# EAGLE design electrode (EAGLE 9.4.2)
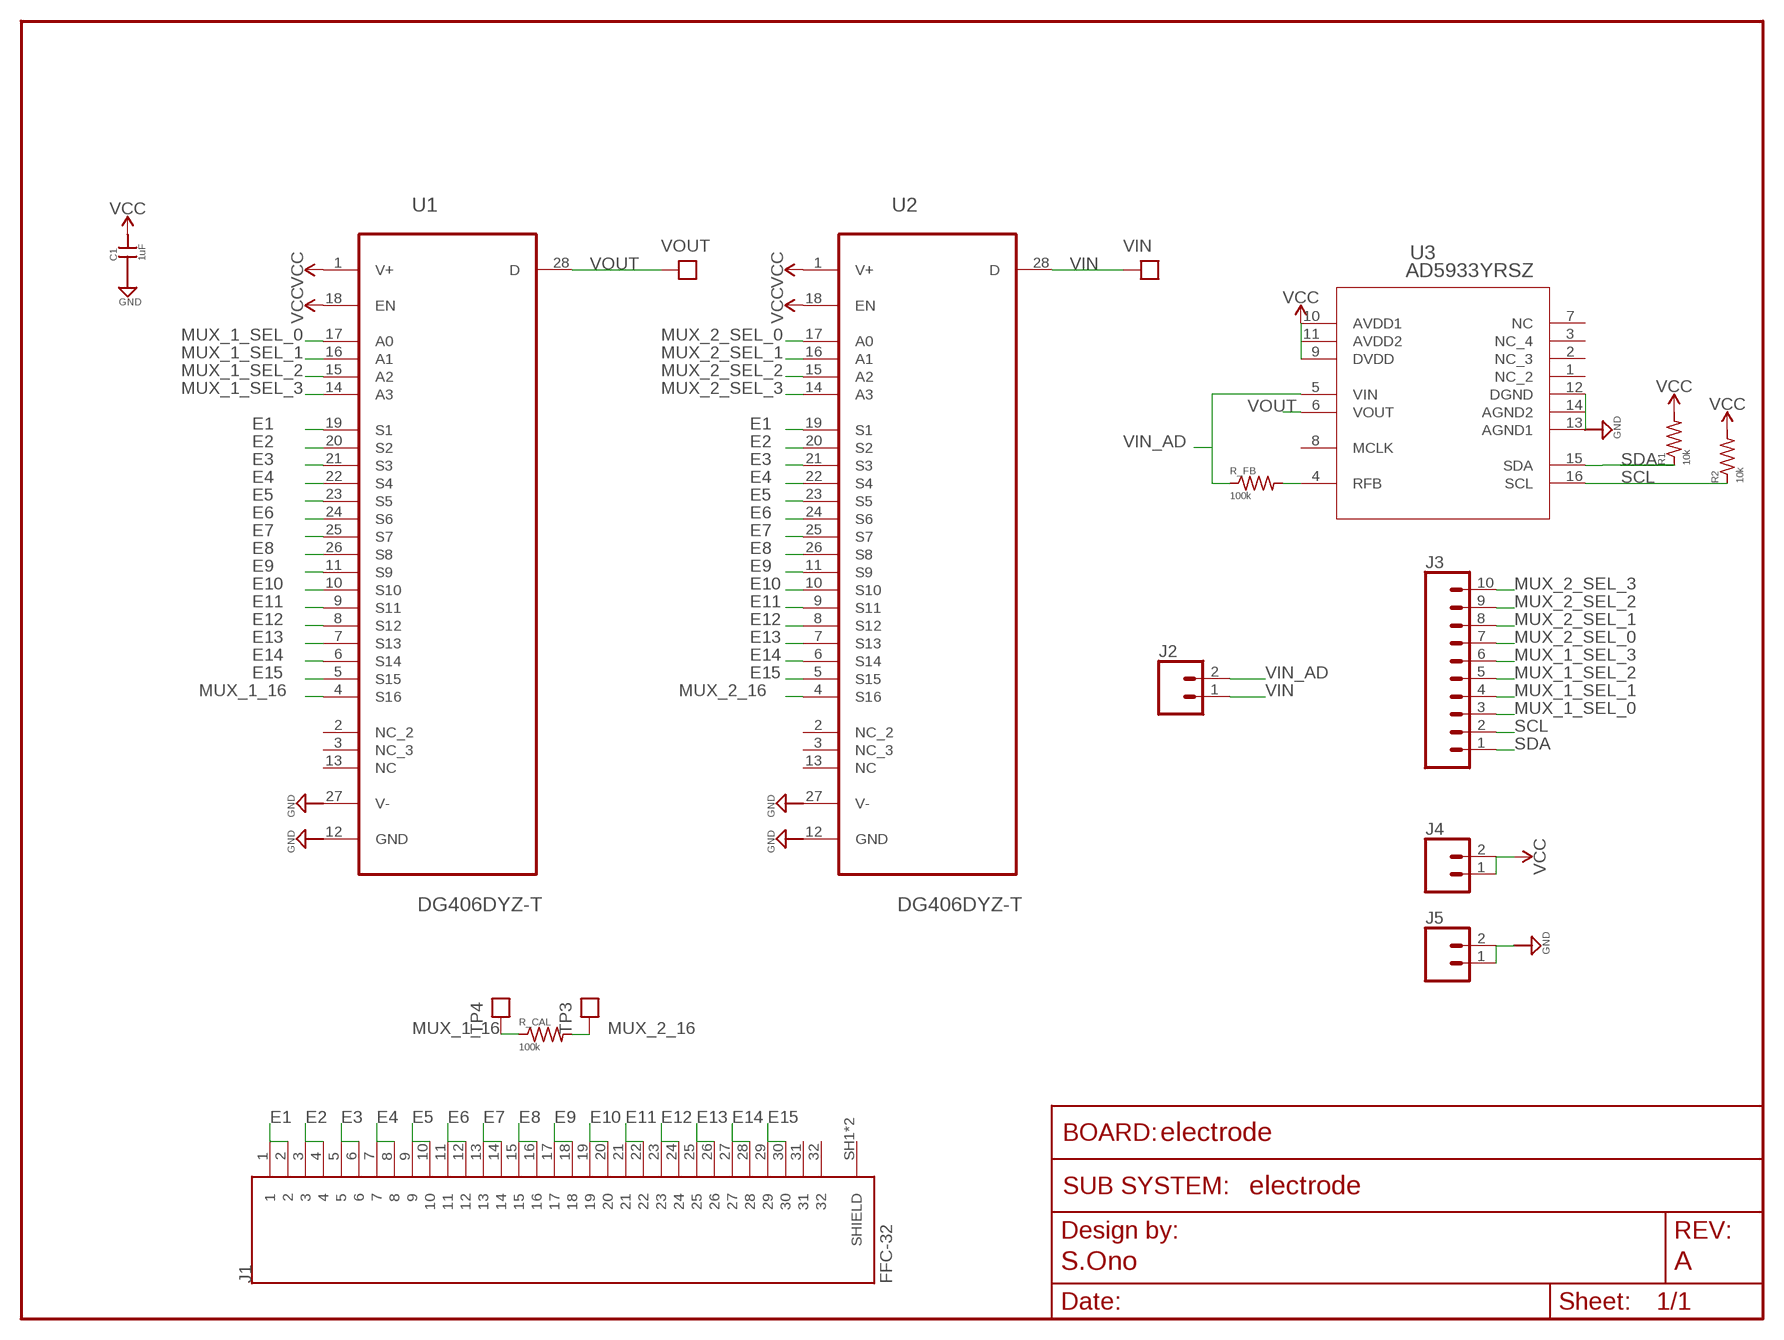
[diagram p0: schematic, sheet 1]
FRAME1 (FRAME_SCHEMATIC): AUTHOR: S.Ono; REV: A; SUBSYSTEM_NAME: electrode

## Parts
C1  1uF  CAP0603-CAP  [0603-CAP]
J1  FFC-32  [MOLEX_503480-3200]
J2  CONN_02  [1X02]
J3  CONN_10"  [1X10]
J4  CONN_02  [1X02]
J5  CONN_02  [1X02]
R1  10k  R-US_0603  [0603-RES]
R2  10k  R-US_0603  [0603-RES]
R_CAL  100k  R-US_0603  [0603-RES]
R_FB  100k  R-US_0603  [0603-RES]
TP3  TEST_POINTTHRU  [TEST_POINT]
TP4  TEST_POINTTHRU  [TEST_POINT]
U1  DG406DYZ-T  [SOIC127P1032X265-28N]
U2  DG406DYZ-T  [SOIC127P1032X265-28N]
U3  AD5933YRSZ  [RS_16]
VIN  TEST_POINTTHRU  [TEST_POINT]
VOUT  TEST_POINTTHRU  [TEST_POINT]

## Nets
E1: J1.1 J1.2 U1.19(S1) U2.19(S1)
E2: J1.3 J1.4 U1.20(S2) U2.20(S2)
E3: J1.5 J1.6 U1.21(S3) U2.21(S3)
E4: J1.7 J1.8 U1.22(S4) U2.22(S4)
E5: J1.9 J1.10 U1.23(S5) U2.23(S5)
E6: J1.11 J1.12 U1.24(S6) U2.24(S6)
E7: J1.13 J1.14 U1.25(S7) U2.25(S7)
E8: J1.15 J1.16 U1.26(S8) U2.26(S8)
E9: J1.17 J1.18 U1.11(S9) U2.11(S9)
E10: J1.19 J1.20 U1.10(S10) U2.10(S10)
E11: J1.21 J1.22 U1.9(S11) U2.9(S11)
E12: J1.23 J1.24 U1.8(S12) U2.8(S12)
E13: J1.25 J1.26 U1.7(S13) U2.7(S13)
E14: J1.27 J1.28 U1.6(S14) U2.6(S14)
E15: J1.29 J1.30 U1.5(S15) U2.5(S15)
GND: C1.1 J5.1 J5.2 U1.12(GND) U1.27(V-) U2.12(GND) U2.27(V-) U3.12(DGND) U3.13(AGND1) U3.14(AGND2)
MUX_1_16: R_CAL.1 TP4.1 U1.4(S16)
MUX_1_SEL_0: J3.3 U1.17(A0)
MUX_1_SEL_1: J3.4 U1.16(A1)
MUX_1_SEL_2: J3.5 U1.15(A2)
MUX_1_SEL_3: J3.6 U1.14(A3)
MUX_2_16: R_CAL.2 TP3.1 U2.4(S16)
MUX_2_SEL_0: J3.7 U2.17(A0)
MUX_2_SEL_1: J3.8 U2.16(A1)
MUX_2_SEL_2: J3.9 U2.15(A2)
MUX_2_SEL_3: J3.10 U2.14(A3)
N$3: R_FB.2 U3.4(RFB)
SCL: J3.2 R2.1 U3.16(SCL)
SDA: J3.1 R1.1 U3.15(SDA)
VCC: C1.2 J4.1 J4.2 R1.2 R2.2 U1.1(V+) U1.18(EN) U2.1(V+) U2.18(EN) U3.9(DVDD) U3.10(AVDD1) U3.11(AVDD2)
VIN: J2.1 U2.28(D) VIN.1
VIN_AD: J2.2 R_FB.1 U3.5(VIN)
VOUT: U1.28(D) U3.6(VOUT) VOUT.1
Unconnected: J1.31 J1.32 J1.SH1(SHIELD) J1.SH2(SHIELD) U1.2(NC_2) U1.3(NC_3) U1.13(NC) U2.2(NC_2) U2.3(NC_3) U2.13(NC) U3.1(NC_2) U3.2(NC_3) U3.3(NC_4) U3.7(NC) U3.8(MCLK)

## Library data of the parts
C1 = scono:CAP: Capacitor Standard 0603 ceramic capacitor, and 0.1" leaded capacitor.; PIE-INT-REF-NUM: CAPACITOR-GENERIC
J1 = scono:FFC-32: 0.50mm Pitch Easy-On™ BackFlip™ Type FPC Connector, 1.00mm Height, Right Angle, SMT, Dual Contact Style, 32 Circuits; DESCRIPTION: 0.50mm Pitch Easy-On™ BackFlip™ Type FPC Connector, 1.00mm Height, Right Angle, Surface Mount, Dual Contact Style, 32...; DIGI-KEY_PART_NUMBER: WM11115CT-ND; DIGI-KEY_PURCHASE_URL: https://www.digikey.com/product-detail/en/molex/5034803200/WM11115CT-ND/5171273?utm_source=snapeda&utm_medium=aggregator&utm_campaign=symbol; MF: Molex; MP: 5034803200; PACKAGE: None
J2 J4 J5 = scono:CONN_02: Multi connection point. Often used as Generic Header-pin footprint for 0.1 inch spaced/style header connections On any of the 0.1 inch spaced packages, you can populate with these: Break Away Headers - Straight <https://www.sparkfun.com/products/116> (PRT-00116) Break Away Male Headers - Right Angle <https://www.sparkfun.com/products/553> (PRT-00553) Female Headers <https://www.sparkfun.com/products/115> (PRT-00115) Break Away Headers - Machine Pin <https://www.sparkfun.com/products/117> (PRT-00117) Break Away Female Headers - Swiss Machine Pin <https://www.sparkfun.com/products/743> (PRT-00743) For SCREWTERMINALS and SPRING TERMINALS visit here: Screw Terimnals on SparkFun.com <https://www.sparkfun.com/search/results?term=Screw+Terminals> (5mm/3.5mm/2.54mm spacing) This device is also useful as a general connection point to wire up your design to another part of your project. Our various solder wires solder well into these plated through hole pads. Hook-Up Wire - Assortment (Stranded, 22 AWG) <https://www.sparkfun.com/products/11375> (PRT-11375) Hook-Up Wire - Assortment (Solid Core, 22 AWG) <https://www.sparkfun.com/products/11367> (PRT-11367) View the entire wire category on our website here <https://www.sparkfun.com/categories/141> Special notes: Molex polarized connector foot print use with: PRT-08233 with associated crimp pins and housings. 2.54_SCREWTERM for use with PRT-10571. 3.5mm Screw Terminal footprints for PRT-08084 5mm Screw Terminal footprints for use with PRT-08432
J3 = scono:CONN_10: Multi connection point. Often used as Generic Header-pin footprint for 0.1 inch spaced/style header connections On any of the 0.1 inch spaced packages, you can populate with these: Break Away Headers - Straight <https://www.sparkfun.com/products/116> (PRT-00116) Break Away Male Headers - Right Angle <https://www.sparkfun.com/products/553> (PRT-00553) Female Headers <https://www.sparkfun.com/products/115> (PRT-00115) Break Away Headers - Machine Pin <https://www.sparkfun.com/products/117> (PRT-00117) Break Away Female Headers - Swiss Machine Pin <https://www.sparkfun.com/products/743> (PRT-00743) Arduino Stackable Header - 10 Pin <https://www.sparkfun.com/products/11376> (PRT-11376) For SCREWTERMINALS and SPRING TERMINALS visit here: Screw Terimnals on SparkFun.com <https://www.sparkfun.com/search/results?term=Screw+Terminals> (5mm/3.5mm/2.54mm spacing) This device is also useful as a general connection point to wire up your design to another part of your project. Our various solder wires solder well into these plated through hole pads. Hook-Up Wire - Assortment (Stranded, 22 AWG) <https://www.sparkfun.com/products/11375> (PRT-11375) Hook-Up Wire - Assortment (Solid Core, 22 AWG) <https://www.sparkfun.com/products/11367> (PRT-11367) View the entire wire category on our website here <https://www.sparkfun.com/categories/141> Special notes: Molex polarized connector foot print use with SKU : PRT-08231 with associated crimp pins and housings. 1MM SMD Version SKU: PRT-10208 NOTES ON THE VARIANTS LOCK and LOCK_LONGPADS... This footprint was designed to help hold the alignment of a through-hole component (i.e. 6-pin header) while soldering it into place. You may notice that each hole has been shifted either up or down by 0.005 of an inch from it's more standard position (which is a perfectly straight line). This slight alteration caused the pins (the squares in the middle) to touch the edges of the holes. Because they are alternating, it causes a "brace" to hold the component in place. 0.005 has proven to be the perfect amount of "off-center" position when using our standard breakaway headers. Although looks a little odd when you look at the bare footprint, once you have a header in there, the alteration is very hard to notice. Also,if you push a header all the way into place, it is covered up entirely on the bottom side.; PROD_ID: CONN-11563
R1 R2 R_CAL R_FB = scono:R-US_: RESISTOR, American symbol
TP3 TP4 VIN VOUT = scono:TEST_POINT: 1206 Test point for O-scope probes. For A106146CT-ND or similar
U1 U2 = scono:DG406DYZ-T: Single 16-Channel/Differential 8-Channel CMOS Analog Multiplexers; DESCRIPTION: DG406 Series 16 Channel _1 x 16: 1_ 50 Ohm CMOS Analog Multiplexer - SOIC-28; DIGI-KEY_PART_NUMBER: DG406DYZ-TCT-ND; DIGI-KEY_PURCHASE_URL: https://www.digikey.com/product-detail/en/renesas-electronics-america-inc/DG406DYZ-T/DG406DYZ-TCT-ND/3603194?utm_source=snapeda&utm_medium=aggregator&utm_campaign=symbol; MF: Renesas Electronics; MP: DG406DYZ-T; PACKAGE: SOIC-28 Intersil
U3 = scono:AD5933YRSZ: https://www.digikey.com/product-detail/en/AD5933YRSZ/AD5933YRSZ-ND/756602?utm_campaign=buynow&WT.z_cid=ref_octopart_dkc_buynow&utm_medium=aggregator&curr=usd&site=us&utm_source=octopart; MANUFACTURER_PART_NUMBER: AD5933YRSZ; VENDOR: Analog Devices Inc

## Board
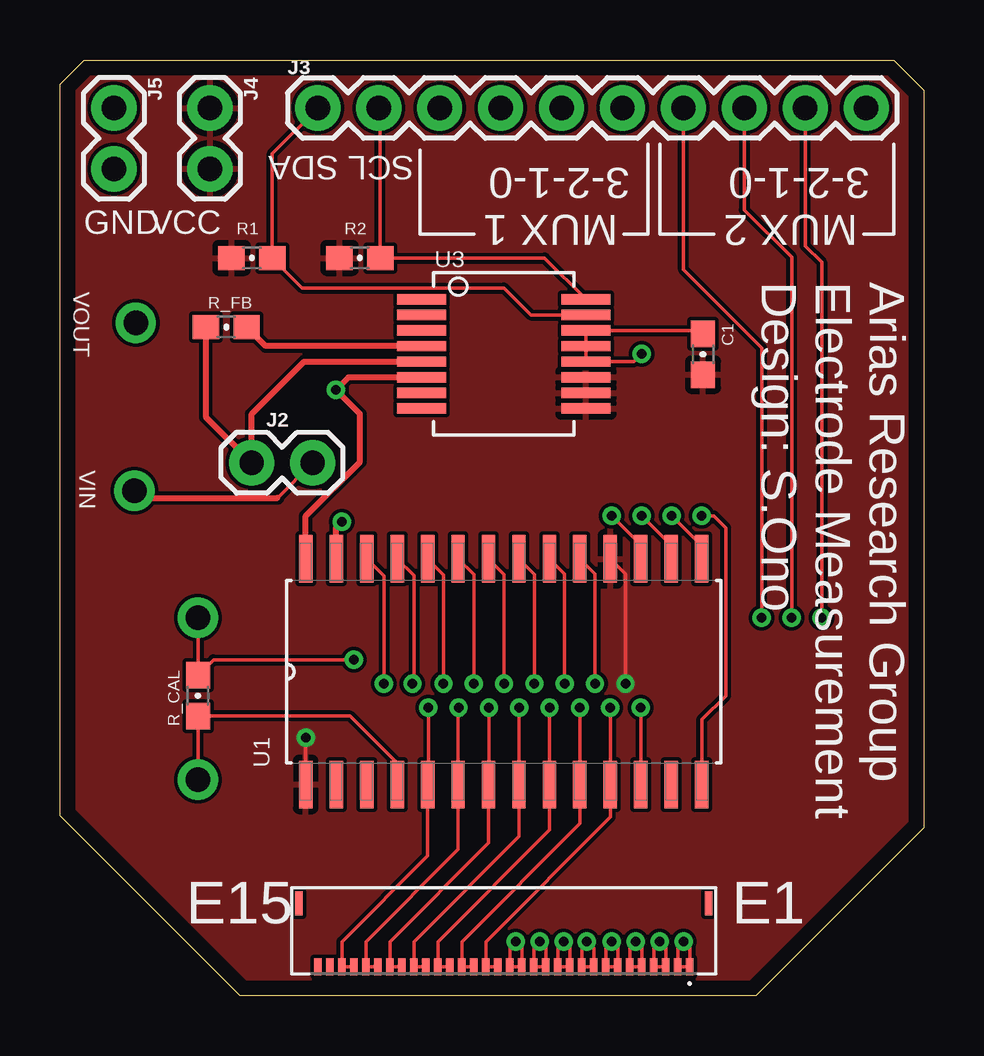
[diagram p1: board, top side]
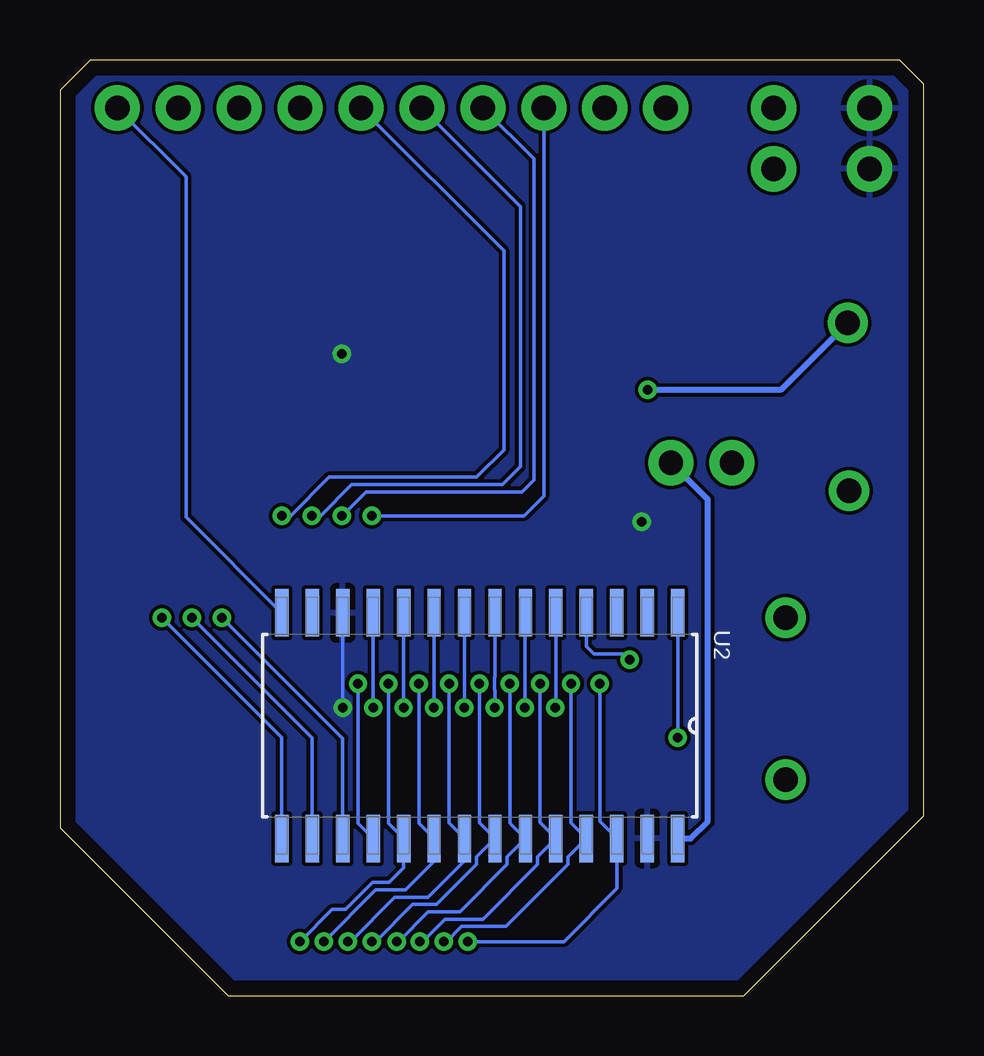
[diagram p2: board, bottom side, seen from below]

Size 36 x 39 mm. Coordinates in mm from the lower left corner, seen from the top.
Outline: 34.75,39 36,37.75 36,7 29,0 7.5,0 0,7.5 0,38 1,39 34.5,39 34.75,39
Copper layers (1*16): Top 2mil / dielectric 9mil / Bottom 2mil
Design rules "scono": minimum track width 6mil, minimum drill 15mil, track to track 6mil, track to pad 6mil, pad to pad 6mil, via to via 6mil, smd to smd 6mil, copper to edge 25mil, drill to drill 7mil, minimum pad ring 7mil, minimum via ring 7mil, stop-mask expansion 3mil, vias tented up to drill 0mil, thermal gap 10mil

### Footprints (pad centres in the part's own frame; a part is rotated, then mirrored left to right if it is on the bottom)
0603-CAP = smd 1.1 x 1: 1 -0.85,0; 2 0.85,0
MOLEX_503480-3200 = smd 0.3 x 0.7: 1 -7.75,1.8; 2 -7.25,1.8; 3 -6.75,1.8; 4 -6.25,1.8; 5 -5.75,1.8; 6 -5.25,1.8; 7 -4.75,1.8; 8 -4.25,1.8; 9 -3.75,1.8; 10 -3.25,1.8; 11 -2.75,1.8; 12 -2.25,1.8; 13 -1.75,1.8; 14 -1.25,1.8; 15 -0.75,1.8; 16 -0.25,1.8; 17 0.25,1.8; 18 0.75,1.8; 19 1.25,1.8; 20 1.75,1.8; 21 2.25,1.8; 22 2.75,1.8; 23 3.25,1.8; 24 3.75,1.8; 25 4.25,1.8; 26 4.75,1.8; 27 5.25,1.8; 28 5.75,1.8; 29 6.25,1.8; 30 6.75,1.8; 31 7.25,1.8; 32 7.75,1.8 | smd 0.3 x 1: SH1 -8.54,-0.85; SH2 8.54,-0.85
1X02 = drill 1.016 pad 1.88: 1 0,0; 2 2.54,0
1X10 = drill 1.016 pad 1.88: 1 0,0; 2 2.54,0; 3 5.08,0; 4 7.62,0; 5 10.16,0; 6 12.7,0; 7 15.24,0; 8 17.78,0; 9 20.32,0; 10 22.86,0
0603-RES = smd 1.1 x 1: 1 -0.85,0; 2 0.85,0
TEST_POINT = drill 1.016 pad 1.676: 1 0,0
SOIC127P1032X265-28N = smd 1.981 x 0.559: 1 -4.699,8.255; 2 -4.699,6.985; 3 -4.699,5.715; 4 -4.699,4.445; 5 -4.699,3.175; 6 -4.699,1.905; 7 -4.699,0.635; 8 -4.699,-0.635; 9 -4.699,-1.905; 10 -4.699,-3.175; 11 -4.699,-4.445; 12 -4.699,-5.715; 13 -4.699,-6.985; 14 -4.699,-8.255; 15 4.699,-8.255; 16 4.699,-6.985; 17 4.699,-5.715; 18 4.699,-4.445; 19 4.699,-3.175; 20 4.699,-1.905; 21 4.699,-0.635; 22 4.699,0.635; 23 4.699,1.905; 24 4.699,3.175; 25 4.699,4.445; 26 4.699,5.715; 27 4.699,6.985; 28 4.699,8.255
RS_16 = smd 2.057 x 0.432: 1 -3.429,2.275; 2 -3.429,1.625; 3 -3.429,0.975; 4 -3.429,0.325; 5 -3.429,-0.325; 6 -3.429,-0.975; 7 -3.429,-1.625; 8 -3.429,-2.275; 9 3.429,-2.275; 10 3.429,-1.625; 11 3.429,-0.975; 12 3.429,-0.325; 13 3.429,0.325; 14 3.429,0.975; 15 3.429,1.625; 16 3.429,2.275

### Placement (x,y rotation side)
C1  26.81,26.73 270 top
J1  18.5,3 180 top
J2  10.53,22.21 180 top
J3  10.75,37 0 top
J4  6.25,37 270 top
J5  2.25,37 270 top
R1  8,30.75 180 top
R2  12.5,30.75 180 top
R_CAL  5.75,12.5 90 top
R_FB  6.93,27.87 0 top
TP3  5.75,15.75 180 top
TP4  5.75,9 180 top
U1  18.5,13.5 90 top
U2  18.5,11.25 270 bottom
U3  18.5,26.75 0 top
VIN  3.1,21.04 0 top
VOUT  3.16,28.04 0 top

### Tracks (layer width: path | path; a pad name or v marks a point on that pad's centre or on a via)
E1  (via drill 0.4)
  Top 0.152: U1.19 22.31,17.57 v22.31,13 | J1.2 J1.1 26.25,2 v26,2.25 25.75,2 J1.2
  Bottom 0.152: v22.31,13 22.31,7.18 U2.19 21.68,5.33 22.29,4.71 22.97,4.71 24.09,3.59 24.66,3.59 v26,2.25
E2  (via drill 0.4)
  Top 0.152: U1.20 21.04,17.56 v21.04,13 | J1.4 J1.3 25.25,2 v25,2.25 24.75,2 J1.4
  Bottom 0.152: v21.04,13 21.04,7.19 U2.20 20.41,5.59 21.59,4.41 22.84,4.41 v25,2.25
E3  (via drill 0.4)
  Top 0.152: U1.21 19.78,17.56 v19.78,13 | J1.6 J1.5 24.25,2 v24,2.25 23.75,2 J1.6
  Bottom 0.152: v19.78,13 19.78,7.19 U2.21 19.14,5.62 20.65,4.1 22.04,4.1 23.89,2.25 v24,2.25
E4  (via drill 0.4)
  Top 0.152: U1.22 18.51,17.55 v18.51,13 | J1.8 J1.7 23.25,2 v23,2.25 22.75,2 J1.8
  Bottom 0.152: v18.51,13 18.51,7.2 U2.22 18.63,5.79 18.63,5.47 20.3,3.8 21.31,3.8 22.85,2.25 v23,2.25
E5  (via drill 0.4)
  Top 0.152: U1.23 17.25,17.54 v17.25,13 | J1.10 J1.9 22.25,1.96 v21.96,2.25 21.75,2.04 J1.10
  Bottom 0.152: 17.25,7.21 17.15,7.1 | 17.15,7.1 U2.23 17.36,5.79 17.36,5.47 19.33,3.49 20.65,3.49 21.89,2.25 v21.96,2.25 | v17.25,13 17.25,7.21 | 17.25,7.21 17.15,7.1
E6  (via drill 0.4)
  Top 0.152: v15.99,13 15.99,17.54 U1.24 | J1.12 J1.11 21.25,2 v21,2.25 20.75,2 J1.12
  Bottom 0.152: v15.99,13 15.99,7.21 U2.24 16.09,5.79 16.09,5.47 18.37,3.19 19.96,3.19 20.89,2.25 v21,2.25
E7  (via drill 0.4)
  Top 0.152: U1.25 14.75,17.5 14.75,13.06 v14.69,13 | J1.14 J1.13 20.25,2 v20,2.25 19.75,2 J1.14
  Bottom 0.152: v14.69,13 14.69,7.19 U2.25 14.82,5.79 14.82,5.47 17.4,2.88 19.26,2.88 19.89,2.25 v20,2.25
E8  (via drill 0.4)
  Top 0.152: U1.26 13.5,17.5 v13.5,13 | J1.16 J1.15 19.25,2 v19,2.25 18.75,2 J1.16
  Bottom 0.152: v13.5,13 13.5,7.27 U2.26 12.79,4.46 15,2.25 v19,2.25
E9  (via drill 0.4)
  Top 0.152: J1.17 J1.18 17.75,2.25 22.94,7.44 U1.11 | v22.94,12 U1.11 | U1.11
  Bottom 0.152: U2.11 v22.95,12.01 v22.94,12
E10  (via drill 0.4)
  Top 0.152: J1.19 J1.20 16.75,2.25 21.67,7.17 U1.10 | v21.67,12 U1.10 | U1.10
  Bottom 0.152: U2.10 v21.68,12 v21.67,12
E11  (via drill 0.4)
  Top 0.152: J1.21 J1.22 15.75,2.25 20.41,6.91 20.41,9 | v20.41,12 20.41,9 | 20.41,9 U1.9
  Bottom 0.152: v20.41,12 20.41,12.73 20.41,12.74 20.41,13.26 20.41,13.27 U2.9
E12  (via drill 0.4)
  Top 0.152: J1.23 J1.24 14.75,2.25 19.14,6.63 U1.8 v19.14,12
  Bottom 0.152: v19.14,12 19.14,12.01 19.14,12.73 19.14,12.74 19.14,13.26 19.14,13.27 U2.8
E13  (via drill 0.4)
  Top 0.152: J1.25 J1.26 13.75,2.25 17.86,6.37 U1.7 17.88,8.82 v17.88,12
  Bottom 0.152: v17.88,12 17.86,12.02 17.86,12.72 17.88,12.74 17.88,13.26 17.86,13.28 U2.7
E14  (via drill 0.4)
  Top 0.152: J1.27 J1.28 12.75,2.25 16.59,6.09 U1.6 16.59,11.98 v16.62,12
  Bottom 0.152: v16.62,12 16.62,15.93 U2.6
E15  (via drill 0.4)
  Top 0.152: J1.29 J1.30 11.75,2.25 15.32,5.83 U1.5 15.36,8.83 v15.36,12
  Bottom 0.152: U2.5 15.32,12.03 v15.36,12
GND  (via drill 0.4)
  Top 0.152: v24.21,12 U1.12 | C1.1 26.66,27.73 U3.14 U3.13 U3.12 23.93,26.43 v24.25,26.75
  Top 0.256: U1.27 11.52,19.52 v11.75,19.75
  Bottom 0.152: U2.12 v24.21,12.01 v24.21,12
  pour Bottom: 1,39 0,38 0,7.5 7.5,0 29,0 36,7 36,37.75 34.75,39
MUX_1_16
  Top 0.152: TP4.1 5.75,11.5 R_CAL.1 12.1,11.65 14.05,9.7 U1.4
MUX_1_SEL_0  (via drill 0.4)
  Top 0.152: U1.17 24.21,18.79 v23,20
  Bottom 0.152: J3.3 15.83,20.83 16.66,20 v23,20
MUX_1_SEL_1  (via drill 0.4)
  Top 0.152: U1.16 25.48,18.77 v24.25,20
  Bottom 0.152: J3.4 16.25,34.88 16.25,21.5 16.75,21 23.25,21 v24.25,20
MUX_1_SEL_2  (via drill 0.4)
  Top 0.152: U1.15 26.75,18.75 v25.5,20
  Bottom 0.152: J3.5 16.8,32.9 16.8,22.05 17.55,21.3 23.84,21.3 25.14,20 v25.5,20
MUX_1_SEL_3  (via drill 0.4)
  Top 0.152: U1.14 26.75,11.51 27.75,12.5 27.75,19.5 27.25,20 v26.75,20
  Bottom 0.152: J3.6 17.5,31.05 17.5,22.75 18.64,21.61 24.78,21.61 26.39,20 v26.75,20
MUX_2_16  (via drill 0.4)
  Top 0.152: R_CAL.2 5.95,13.55 | 5.95,13.55 6.4,14 v12.25,14 | TP3.1 5.75,13.75 5.95,13.55
  Bottom 0.152: v12.25,14 12.5,14.25 13.75,14.25 14.05,14.55 U2.4
MUX_2_SEL_0  (via drill 0.4)
  Top 0.152: v29.25,15.75 29.25,27 25.99,30.26 J3.7
  Bottom 0.152: U2.17 24.21,10.71 v29.25,15.75
MUX_2_SEL_1  (via drill 0.4)
  Top 0.152: J3.8 28.53,32.75 30.5,30.78 v30.5,15.75
  Bottom 0.152: U2.16 25.48,10.73 v30.5,15.75
MUX_2_SEL_2  (via drill 0.4)
  Top 0.152: J3.9 31.07,31.25 31.75,30.57 v31.75,15.75
  Bottom 0.152: U2.15 26.75,10.76 v31.75,15.75
MUX_2_SEL_3
  Bottom 0.152: U2.14 30.75,19.94 30.75,34.14 J3.10
N$3
  Top 0.256: U3.4 8.57,27.07 R_FB.2
SCL
  Top 0.152: J3.2 13.27,36.98 13.35,36.9 R2.1 20.2,30.75 U3.16
SDA
  Top 0.152: J3.1 8.85,35.1 R1.1 10.1,29.5 18.5,29.5 19.62,28.38 U3.15
VCC  (via drill 0.4)
  Top 0.152: U1.18 23.58,17.57 v23.58,13 | U1.1 v10.24,10.74 v10.25,10.75
  Bottom 0.152: v23.58,13 23.58,7.18 U2.18 | v10.25,10.75 U2.1
  pour Top: 0,38 0,7.5 7.5,0 29,0 36,7 36,37.75 34.75,39 1,39
VIN
  Top 0.152: 9.07,20.75 J2.1
  Top 0.256: VIN.1 3.39,20.75 9.07,20.75
  Bottom 0.256: U2.28 9.7,6.55 9,7.25 9,20.68 J2.1
VIN_AD
  Top 0.256: R_FB.1 6.08,24.12 J2.2 7.99,24.24 10.18,26.43 U3.5
VOUT  (via drill 0.4)
  Top 0.256: U3.6 12.03,25.77 v11.5,25.25 12.5,24.25 12.5,22.25 10.24,20 U1.28
  Bottom 0.256: VOUT.1 5.95,25.25 v11.5,25.25

### Text on the board
tPlace: SCL SDA | MUX 1 / 3-2-1-0 | MUX 2 / 3-2-1-0 | GND | VCC | Arias Research Group / Electrode Measurement / Design: S.Ono | E15 | E1